# EAGLE schematic CNC_v36 (EAGLE 9.6.2)
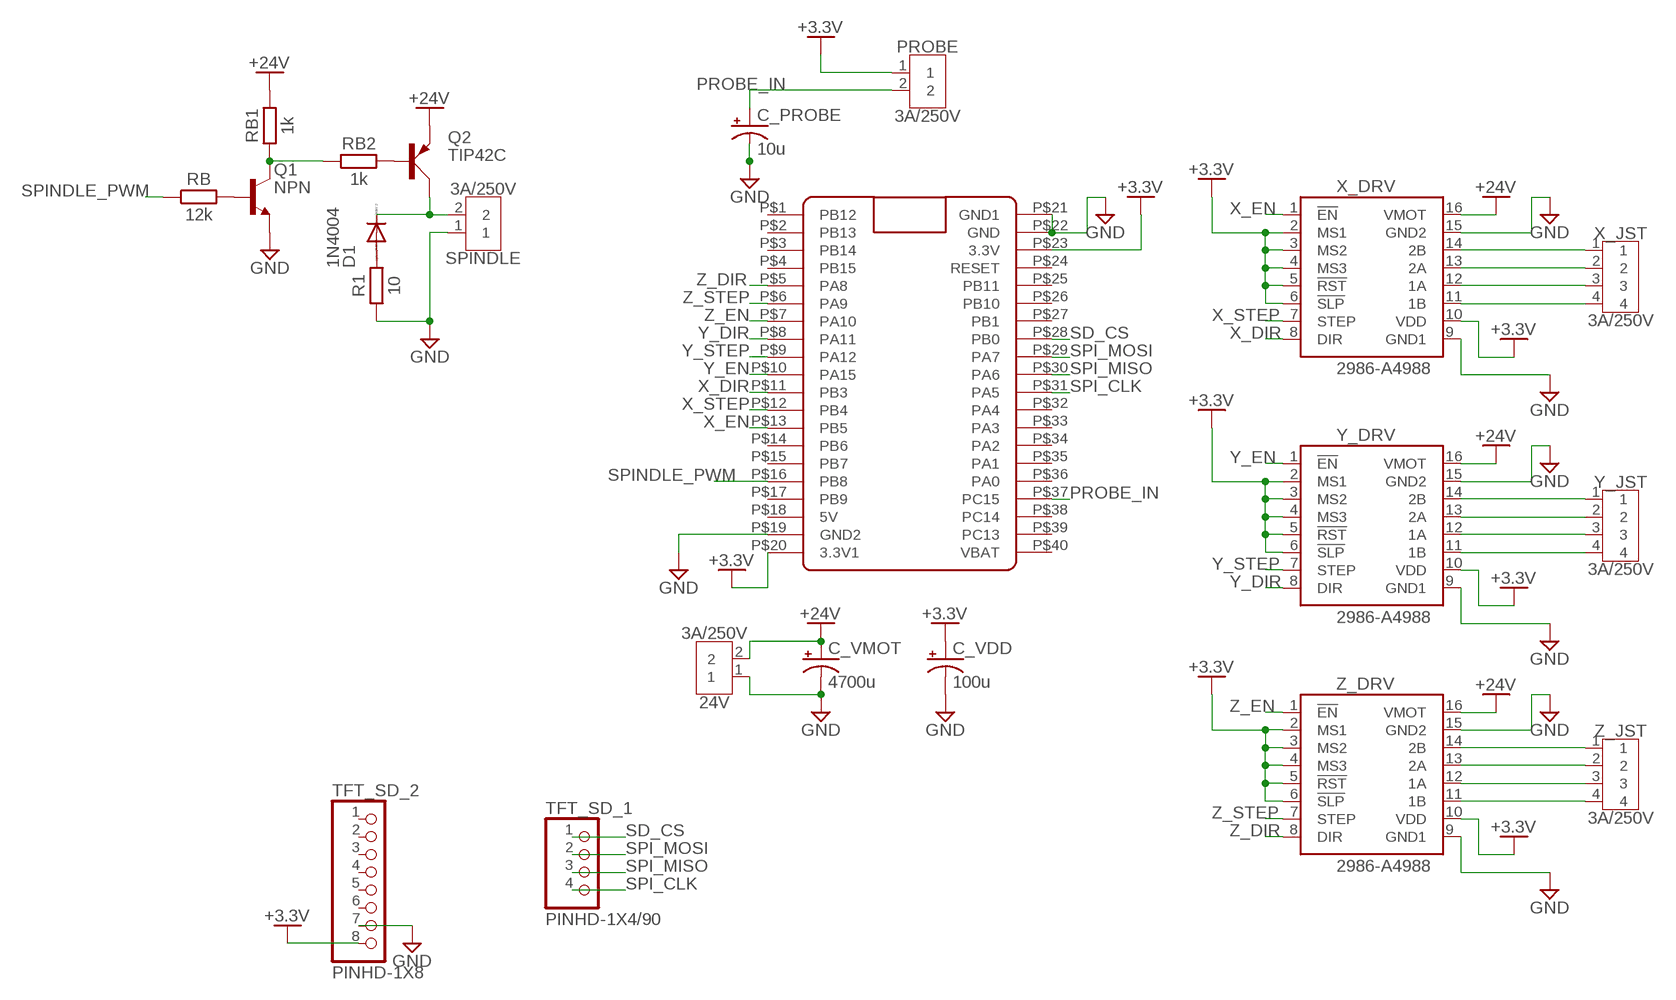
[diagram p0: schematic, sheet 1]

## Parts
24V  3A/250V  B2B-XH-A  [B2B-XH-A]
C_PROBE  10u  C-POL-US_RADIAL-11MM-DIA  [CAPPRD508W65D1000H1100B]
C_VDD  100u  C-POL-US_RADIAL-11MM-DIA  [CAPPRD508W65D1000H1100B]
C_VMOT  4700u  C-POL-US_RADIAL-20MM-DIA  [CAPPRD550W60D1200H2000B]
D1  1N4004  [DO41-10]
PROBE  3A/250V  B2B-XH-A  [B2B-XH-A]
Q1  NPN  NPN_TO92-EBC  [TO92]
Q2  TIP42C  [TO220AV]
R1  10  R_AXIAL-7.2MM-PITCH  [RESAD724W46L381D178B]
RB  12k  R_AXIAL-7.2MM-PITCH  [RESAD724W46L381D178B]
RB1  1k  R_AXIAL-7.2MM-PITCH  [RESAD724W46L381D178B]
RB2  1k  R_AXIAL-7.2MM-PITCH  [RESAD724W46L381D178B]
SPINDLE  3A/250V  B2B-XH-A  [B2B-XH-A]
TFT_SD_1  PINHD-1X4/90  [1X04/90]
TFT_SD_2  PINHD-1X8  [1X08]
U$1  BLUE_PILLADVANCED  [BLUE_PILL_ADV]
X_DRV  2986-A4988  [A4988]
X_JST  3A/250V  B4B-XH-A  [B4B-XH-A]
Y_DRV  2986-A4988  [A4988]
Y_JST  3A/250V  B4B-XH-A  [B4B-XH-A]
Z_DRV  2986-A4988  [A4988]
Z_JST  3A/250V  B4B-XH-A  [B4B-XH-A]

## Nets
+3.3V: C_VDD.1(+) PROBE.1 TFT_SD_2.8 U$1.P$20(3.3V1) U$1.P$23(3.3V) X_DRV.2(MS1) X_DRV.3(MS2) X_DRV.4(MS3) X_DRV.5(!RST) X_DRV.6(!SLP) X_DRV.10(VDD) Y_DRV.2(MS1) Y_DRV.3(MS2) Y_DRV.4(MS3) Y_DRV.5(!RST) Y_DRV.6(!SLP) Y_DRV.10(VDD) Z_DRV.2(MS1) Z_DRV.3(MS2) Z_DRV.4(MS3) Z_DRV.5(!RST) Z_DRV.6(!SLP) Z_DRV.10(VDD)
+24V [pow]: 24V.2 C_VMOT.1(+) Q2.E RB1.2 X_DRV.16(VMOT) Y_DRV.16(VMOT) Z_DRV.16(VMOT)
GND: 24V.1 C_PROBE.2(-) C_VDD.2(-) C_VMOT.2(-) Q1.1(E) R1.1 SPINDLE.1 TFT_SD_2.7 U$1.P$19(GND2) U$1.P$21(GND1) U$1.P$22(GND) X_DRV.9(GND1) X_DRV.15(GND2) Y_DRV.9(GND1) Y_DRV.15(GND2) Z_DRV.9(GND1) Z_DRV.15(GND2)
N$4: Q1.2(B) RB.2
N$5: Q1.3(C) RB1.1 RB2.1
N$6 [pow]: D1.A R1.2
N$7: D1.C Q2.C SPINDLE.2
N$8: Q2.B RB2.2
N$11 [pow]: Y_DRV.11(1B) Y_JST.4
N$12 [pow]: Y_DRV.12(1A) Y_JST.3
N$13 [pow]: Y_DRV.13(2A) Y_JST.2
N$14 [pow]: Y_DRV.14(2B) Y_JST.1
N$27 [pow]: Z_DRV.11(1B) Z_JST.4
N$28 [pow]: Z_DRV.12(1A) Z_JST.3
N$29 [pow]: Z_DRV.13(2A) Z_JST.2
N$30 [pow]: Z_DRV.14(2B) Z_JST.1
N$43 [pow]: X_DRV.11(1B) X_JST.4
N$44 [pow]: X_DRV.12(1A) X_JST.3
N$45 [pow]: X_DRV.13(2A) X_JST.2
N$46 [pow]: X_DRV.14(2B) X_JST.1
PROBE_IN: C_PROBE.1(+) PROBE.2 U$1.P$37(PC15)
SD_CS: TFT_SD_1.1 U$1.P$28(PB0)
SPI_CLK: TFT_SD_1.4 U$1.P$31(PA5)
SPI_MISO: TFT_SD_1.3 U$1.P$30(PA6)
SPI_MOSI: TFT_SD_1.2 U$1.P$29(PA7)
SPINDLE_PWM: RB.1 U$1.P$16(PB8)
X_DIR: U$1.P$11(PB3) X_DRV.8(DIR)
X_EN: U$1.P$13(PB5) X_DRV.1(!EN)
X_STEP: U$1.P$12(PB4) X_DRV.7(STEP)
Y_DIR: U$1.P$8(PA11) Y_DRV.8(DIR)
Y_EN: U$1.P$10(PA15) Y_DRV.1(!EN)
Y_STEP: U$1.P$9(PA12) Y_DRV.7(STEP)
Z_DIR: U$1.P$5(PA8) Z_DRV.8(DIR)
Z_EN: U$1.P$7(PA10) Z_DRV.1(!EN)
Z_STEP: U$1.P$6(PA9) Z_DRV.7(STEP)
Unconnected: TFT_SD_2.1 TFT_SD_2.2 TFT_SD_2.3 TFT_SD_2.4 TFT_SD_2.5 TFT_SD_2.6 U$1.P$1(PB12) U$1.P$2(PB13) U$1.P$3(PB14) U$1.P$4(PB15) U$1.P$14(PB6) U$1.P$15(PB7) U$1.P$17(PB9) U$1.P$18(5V) U$1.P$24(RESET) U$1.P$25(PB11) U$1.P$26(PB10) U$1.P$27(PB1) U$1.P$32(PA4) U$1.P$33(PA3) U$1.P$34(PA2) U$1.P$35(PA1) U$1.P$36(PA0) U$1.P$38(PC14) U$1.P$39(PC13) U$1.P$40(VBAT)

## Library data of the parts
24V PROBE SPINDLE = Connector:B2B-XH-A: XH Connector Top Entry - 2POS Details see: Datasheet <http://www.jst-mfg.com/product/pdf/eng/eXH.pdf>; CATEGORY: CONNECTOR; DESCRIPTION: 2.5mm pitch/disconnectable crimp style connector; MANUFACTURER: JST (XH CONNECTOR); MPN: B2B-XH-A; OPERATING_TEMPERATURE: -25°C ~ 85°C; PART_STATUS: ACTIVE; ROHS_COMPLIANT: COMPLIANT; SERIES: B_B-XH-A; SUB_CATEGORY: Through hole connector; TYPE: top entry
C_PROBE C_VDD C_VMOT = Capacitor:C-POL-US: Capacitor Polarised - ANSI; CATEGORY: Capacitor
D1 = diode:1N4004: DIODE general purpose rectifier, 1 A
Q1 = Transistor:NPN: NPN - Generic; CATEGORY: Transistor; SUB-CATEGORY: BJT; TYPE: NPN
Q2 = TIP42C:TIP42C: PNP TRANSISTOR Check availability <https://pricing.snapeda.com/parts/TIP42C/onsemi/view-part?ref=eda>; AVAILABILITY: In Stock; DESCRIPTION: Bipolar (BJT) Transistor PNP 100 V 6 A 3MHz 2 W Through Hole TO-220-3; MF: onsemi; MP: TIP42C; PACKAGE: TO-220-3 ON; PRICE: None; PURCHASE-URL: https://pricing.snapeda.com/search?q=TIP42C&ref=eda
R1 RB RB1 RB2 = Resistor:R: Resistor Fixed - Generic; CATEGORY: Resistor; SUB-CATEGORY: Fixed
TFT_SD_1 = Connector:PINHD-1X4: PIN HEADER; CATEGORY: CONNECTOR; SUB-CATEGORY: PIN-HEADER
TFT_SD_2 = Connector:PINHD-1X8: PIN HEADER; CATEGORY: CONNECTOR; SUB-CATEGORY: PIN-HEADER
U$1 = BluePill:BLUE_PILL
X_DRV Y_DRV Z_DRV = pololu-stepper-driver:2986-A4988: A4988 Stepper Motor Driver Carrier; Black Edition (Bulk; Header Pins Soldered) #2986 A4988 Stepper Motor Driver Carrier; Black Edition (Bulk; Header Pins Soldered) <https://www.pololu.com/product/2986> in Japan, Suzaku Lab. Ltd. <https://suzakugiken.jp/> #2986 A4988 ステッピングモータドライバボード Black Edition (バルク品 ピンヘッダ実装済み) <https://szc.jp/po2986>
X_JST Y_JST Z_JST = Connector:B4B-XH-A: XH Connector Top Entry - 4POS Details see: Datasheet <http://www.jst-mfg.com/product/pdf/eng/eXH.pdf>; CATEGORY: CONNECTOR; DSECRIPTION: 2.5mm pitch/disconnctable crimp style connector; MANUFACTURER: JST (XH connector); MPN: B4B-XH-A; OPERATING_TEMPERATURE: -25 C to 85 C; PART_STATUS: ACTIVE; ROHS_COMPLIANT: COMPLAINT; SERIES: B4B-XH-A; SUB_CATEGORY: Through hole; TYPE: TOP ENTRY

## Net classes
0 default: width 0.025 mm, clearance 0.051 mm
1 pow: width 0.025 mm, clearance 0.051 mm